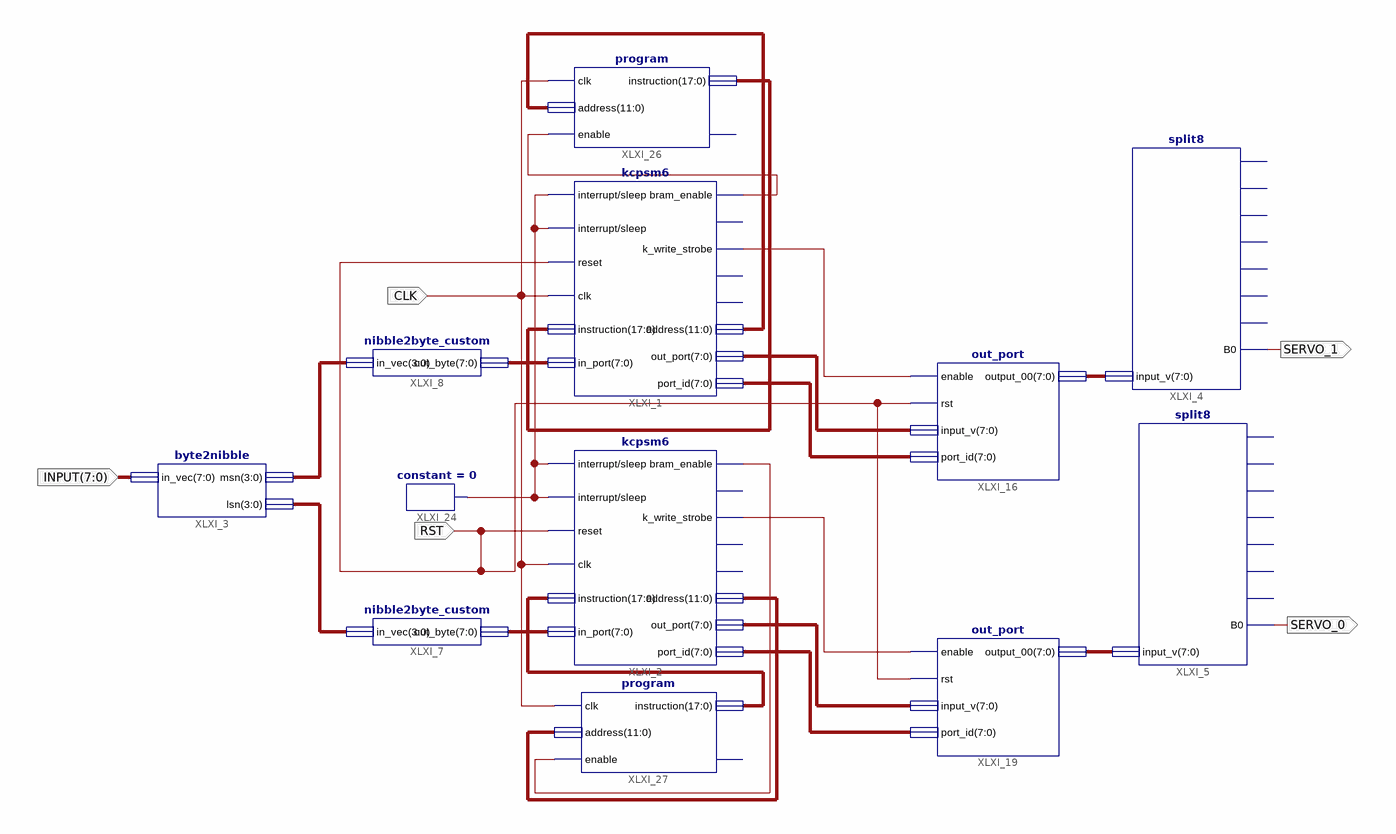
[diagram p0: schematic sheet 1]
// Xilinx ISE schematic main.sch (spartan6) as structural Verilog: 12 symbols, 5 ports
module main (
  input  [7:0] INPUT,
  input  CLK,
  input  RST,
  output SERVO_1,
  output SERVO_0
);

  wire XLXN_35, XLXN_38, XLXN_39, XLXN_103, XLXN_106;
  wire [3:0] XLXN_9, XLXN_10;
  wire [7:0] mo0, mo1, output0, output1, port0, port1, XLXN_6, XLXN_7;
  wire [11:0] XLXN_102, XLXN_105;
  wire [17:0] XLXN_101, XLXN_107;

  kcpsm6 XLXI_1 (
    .interrupt(XLXN_35), .sleep(XLXN_35), .reset(RST), .clk(CLK), .instruction(XLXN_101), .in_port(XLXN_6),
    .bram_enable(XLXN_103), .k_write_strobe(XLXN_39), .address(XLXN_102), .out_port(output1), .port_id(port1));  // open: write_strobe, read_strobe, interrupt_ack
  kcpsm6 XLXI_2 (
    .interrupt(XLXN_35), .sleep(XLXN_35), .reset(RST), .clk(CLK), .instruction(XLXN_107), .in_port(XLXN_7),
    .bram_enable(XLXN_106), .k_write_strobe(XLXN_38), .address(XLXN_105), .out_port(output0), .port_id(port0));  // open: write_strobe, read_strobe, interrupt_ack
  nibble2byte_custom XLXI_7 (.in_vec(XLXN_9), .out_byte(XLXN_7));
  nibble2byte_custom XLXI_8 (.in_vec(XLXN_10), .out_byte(XLXN_6));
  byte2nibble XLXI_3 (.in_vec(INPUT), .msn(XLXN_10), .lsn(XLXN_9));
  split8 XLXI_4 (.input_v(mo1), .B0(SERVO_1));  // open: B7, B6, B5, B4, B3, B2, B1
  split8 XLXI_5 (.input_v(mo0), .B0(SERVO_0));  // open: B7, B6, B5, B4, B3, B2, B1
  out_port XLXI_16 (.enable(XLXN_39), .rst(RST), .input_v(output1), .port_id(port1), .output_00(mo1));
  out_port XLXI_19 (.enable(XLXN_38), .rst(RST), .input_v(output0), .port_id(port0), .output_00(mo0));
  constant #(.CValue("0")) XLXI_24 (.O(XLXN_35));
  \program  XLXI_26 (.clk(CLK), .address(XLXN_102), .instruction(XLXN_101), .enable(XLXN_103));  // open: rdl
  \program  XLXI_27 (.clk(CLK), .address(XLXN_105), .instruction(XLXN_107), .enable(XLXN_106));  // open: rdl
endmodule
